# Altium schematic sheet current amplifier 03.SchDoc: PHOTOELECTRIC EFFECT
size A3; ApprovedBy: NHOPPASIT S.; CheckedBy: NHOPPASIT S.; Author: NHOPPASIT S.; DrawnBy: NHOPPASIT S.; DocumentNumber: EE-01; Revision: 1; SheetNumber: 1; SheetTotal: 1; Size: A3; PageSetup: Record=PageOptions?CenterHorizontal=True?CenterVertical=True?PrintScale=0.96?XCorrection=1.00?YCorrection=1.00?PrintKind=0?BorderSize=5000000?LeftOffset=0?BottomOffset=0?Orientation=2?PaperLength=1000?PaperWidth=1000?Scale=100?PaperSource=7?PrintQuality=-4?MediaType=1?DitherType=10?PaperKind=A4?PrintScaleMode=1; DocumentName: PHOTOELECTRIC EFFECT SCH; ProjectName: PHOTOELECTRIC EFFECT 01
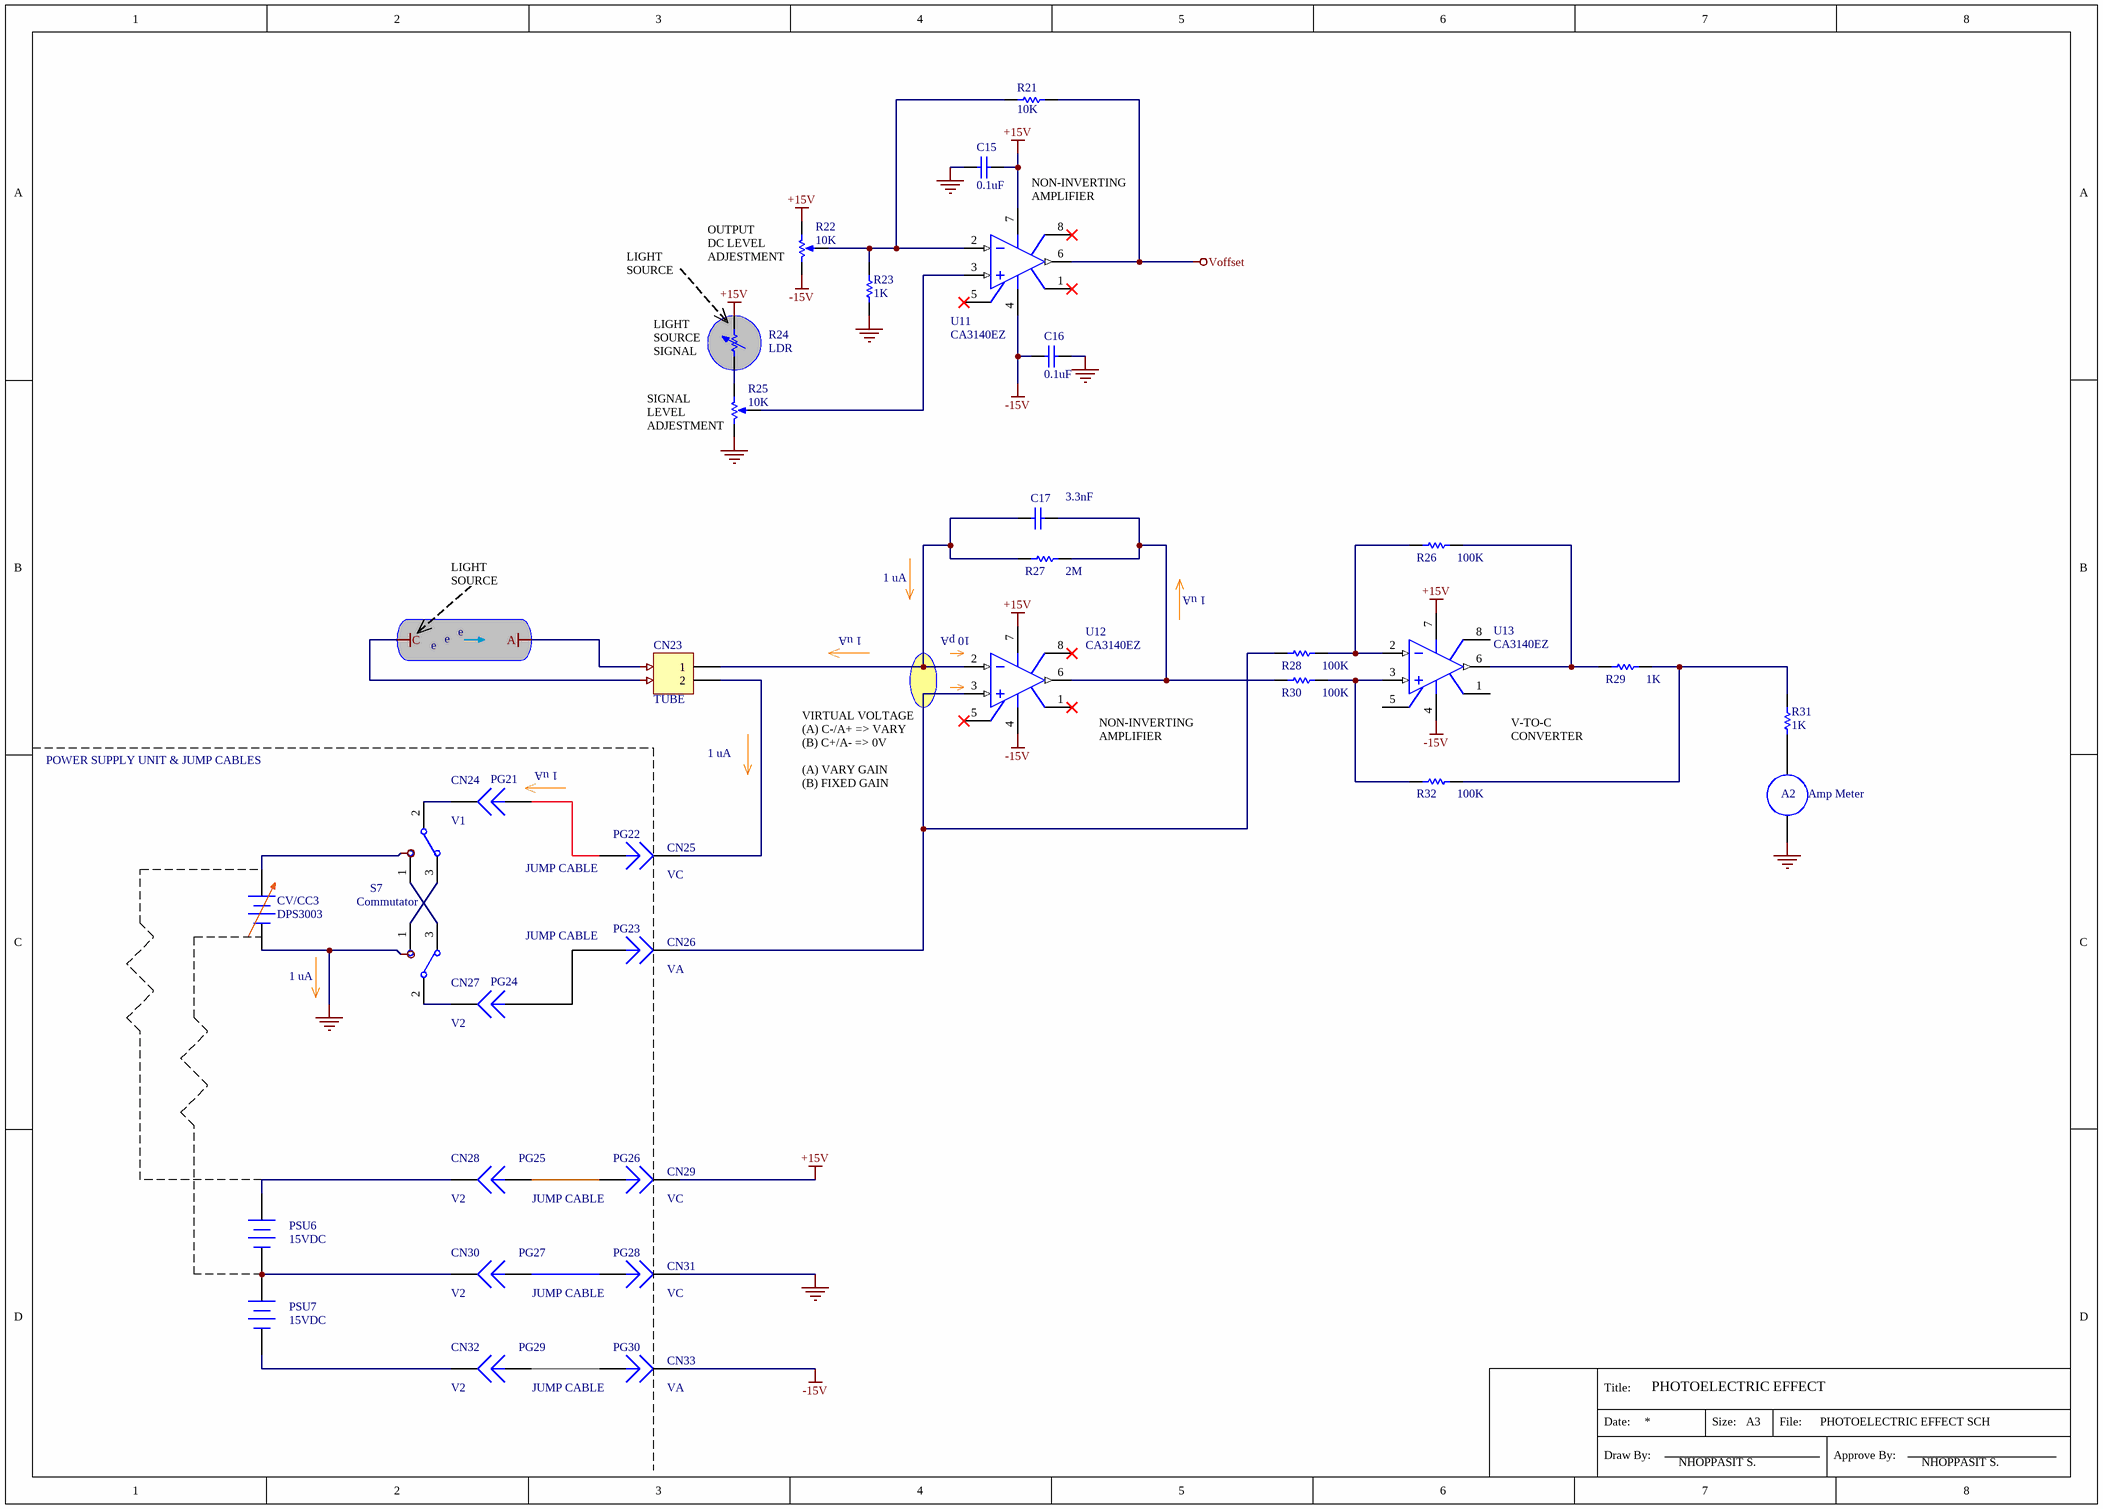
[diagram p0: current amplifier 03.SchDoc]

## Parts
A2  Amp Meter  [RAD-0.1]
C15  0.1uF  [RAD-0.3]
C16  0.1uF  [RAD-0.3]
C17  3.3nF  [RAD-0.3]
CN23  TUBE  [HDR1X2]
CN24  V1  [PIN1]
CN25  VC  [PIN1]
CN26  VA  [PIN1]
CN27  V2  [PIN1]
CN28  V2  [PIN1]
CN29  VC  [PIN1]
CN30  V2  [PIN1]
CN31  VC  [PIN1]
CN32  V2  [PIN1]
CN33  VA  [PIN1]
CV/CC3  DPS3003  [BAT-2]
PG21  Plug  [PIN1]  (value not drawn)
PG22  Plug  [PIN1]  (value not drawn)
PG23  Plug  [PIN1]  (value not drawn)
PG24  Plug  [PIN1]  (value not drawn)
PG25  Plug  [PIN1]  (value not drawn)
PG26  Plug  [PIN1]  (value not drawn)
PG27  Plug  [PIN1]  (value not drawn)
PG28  Plug  [PIN1]  (value not drawn)
PG29  Plug  [PIN1]  (value not drawn)
PG30  Plug  [PIN1]  (value not drawn)
PSU6  15VDC  [BAT-2]
PSU7  15VDC  [BAT-2]
R21  10K  [AXIAL-0.3]
R22  10K  [VR5]
R23  1K  [AXIAL-0.3]
R24  LDR  [AXIAL-0.7]
R25  10K  [VR5]
R26  100K  [AXIAL-0.3]
R27  2M  [AXIAL-0.3]
R28  100K  [AXIAL-0.3]
R29  1K  [AXIAL-0.3]
R30  100K  [AXIAL-0.3]
R31  1K  [AXIAL-0.3]
R32  100K  [AXIAL-0.3]
S7  Commutator  [TL36WW15050]
S8  SW-SPDT  [TL36WW15050]  (value not drawn)
U11  CA3140EZ  [H-08A]
U12  CA3140EZ  [H-08A]
U13  CA3140EZ  [H-08A]

## Nets
+15V: C15.2 CN29.1 R22.1(TOP) R24.2 U11.7(V+) U12.7(V+) U13.7(V+)
-15V: C16.1 CN33.1 R22.2(BOT) U11.4(V-) U12.4(V-) U13.4(V-)
A: A2.1 C15.1 C16.2 CN31.1 CV/CC3.1(+) CV/CC3.2(-) R23.1 R25.2(BOT)  [also labelled C, GND, VCC]
Voffset: R21.2 U11.6(OUT)
NetA2_2: A2.2 R31.1
NetC17_1: C17.1 CN23.1 R27.1 U12.2(IN-)
NetC17_2: C17.2 R27.2 R30.1 U12.6(OUT)
NetCN23_2: CN23.2 CN25.1
NetCN24_1: CN24.1 S7.2
NetCN26_1: CN26.1 R28.1 U12.3(IN+)
NetCN27_1: CN27.1 S8.2
NetCN28_1: CN28.1 PSU6.1(+)
NetCN30_1: CN30.1 PSU6.2(-) PSU7.1(+)
NetCN32_1: CN32.1 PSU7.2(-)
NetPG21_1: PG21.1 PG22.1
NetPG23_1: PG23.1 PG24.1
NetPG25_1: PG25.1 PG26.1
NetPG27_1: PG27.1 PG28.1
NetPG29_1: PG29.1 PG30.1
NetR21_1: R21.1 R22.3(TAP) R23.2 U11.2(IN-)
NetR24_1: R24.1 R25.1(TOP)
NetR25_3: R25.3(TAP) U11.3(IN+)
NetR26_1: R26.1 R28.2 U13.2(IN-)
NetR26_2: R26.2 R29.1 U13.6(OUT)
NetR29_2: R29.2 R31.2 R32.2
NetR30_2: R30.2 R32.1 U13.3(IN+)
NetS7_1: S7.1 S8.3
NetS7_3: S7.3 S8.1

Not connected (* = marked no-connect by the designer): U11 1(OS_NUL)* 5(OS_NUL)* 8(TAB)*; U12 1(OS_NUL)* 5(OS_NUL)* 8(TAB)*; U13 1(OS_NUL) 5(OS_NUL) 8(TAB)

## Notes on the sheet
- NON-INVERTING
  AMPLIFIER
- LIGHT SOURCE
- (near R22) OUTPUT
  DC LEVEL
  ADJESTMENT
- (near R24) LIGHT SOURCE
  SIGNAL
- (near R25) SIGNAL
  LEVEL
  ADJESTMENT
- 1 uA
- e
- (near U12) 10 pA
- POWER SUPPLY UNIT & JUMP CABLES
- (near PG21) 1 uA
- V-TO-C
  CONVERTER
- VIRTUAL VOLTAGE
  (A) C-/A+ => VARY
  (B) C+/A- => 0V
  (A) VARY GAIN
  (B) FIXED GAIN
- JUMP CABLE
- Title:
- Date:
- Draw By:
- Size:
- File:
- Approve By:

## Library data of the parts
A2 = Meter: Indicating Instrument; Note: Place a "letter" into the symbol to show the function of the meter or instrument; Published: 24-Mar-1999; LatestRevisionDate: 17-Jul-2002; LatestRevisionNote: Re-released for DXP Platform.; PackageReference: RAD-0.1; Publisher: Altium Limited; PackageDescription: Radial Cap, Thru-Hole; 2 Leads; 0.1 in Pin Spacing
C15-C17 = Cap: Capacitor; Published: 8-Jun-2000; LatestRevisionDate: 17-Jul-2002; LatestRevisionNote: Re-released for DXP Platform.; PackageReference: RAD-0.3; Publisher: Altium Limited; PackageDescription: Radial Cap, Thru-Hole; 2 Leads; 0.3 in Pin Spacing
  C15 C16: Value: 0.1uF
  C17: Value: 3.3nF
CN23 = Header 2: Header, 2-Pin; LatestRevisionDate: 17-Jul-2002; LatestRevisionNote: Re-released for DXP Platform.; Publisher: Altium Limited
CN24-CN33 = Socket: LatestRevisionDate: 17-Jul-2002; LatestRevisionNote: Re-released for DXP Platform.; Publisher: Altium Limited
CV/CC3 PSU6 PSU7 = Battery: Multicell Battery; Published: 24-Mar-1999; LatestRevisionDate: 17-Jul-2002; LatestRevisionNote: Re-released for DXP Platform.; PackageReference: BAT-2; Publisher: Altium Limited; PackageDescription: Battery; 2 Leads
R21 R23 R26-R32 = Res1: Resistor; Published: 8-Jun-2000; LatestRevisionDate: 17-Jul-2002; LatestRevisionNote: Re-released for DXP Platform.; PackageReference: AXIAL-0.3; Publisher: Altium Limited; PackageDescription: Axial Device, Thru-Hole; 2 Leads; 0.3 in Pin Spacing
  R21: Value: 10K
  R23 R29 R31: Value: 1K
  R26 R28 R30 R32: Value: 100K
  R27: Value: 2M
R22 R25 = RPot: Potentiometer; Sim Note: Enter the Resistance value and the set point into parameter fields.; Set Position: 0.5; Published: 8-Jun-2000; LatestRevisionDate: 17-Jul-2002; LatestRevisionNote: Re-released for DXP Platform.; PackageReference: VR5; Publisher: Altium Limited; PackageDescription: Variable Resistor, Thru-Hole; 3 Leads; Value: 10K
R24 = Res Adj1: Variable Resistor; Value: 1K; Set Position: 0.5; Published: 8-Jun-2000; LatestRevisionDate: 17-Jul-2002; LatestRevisionNote: Re-released for DXP Platform.; PackageReference: AXIAL-0.7; Publisher: Altium Limited; PackageDescription: Axial Device, Thru-Hole; 2 Leads; 0.7 in Pin Spacing
S7 S8 = SW-SPDT: SPDT Subminiature Toggle Switch, Right Angle Mounting, Vertical Actuation; Published: 24-Mar-1999; LatestRevisionDate: 17-Dec-2003; LatestRevisionNote: Schematic revised, PCB Footprint replaced.; DatasheetVersion: 05-Dec-2000; PackageReference: TL36WW15050; Publisher: Altium Limited; PackageDescription: Switch; 4 Leads; ComponentLink1Description: Manufacturer Link; ComponentLink1URL: http://www.apem.com
U11-U13 = Op Amp: FET Operational Amplifier; Published: 8-Jun-2000; LatestRevisionDate: 17-Jul-2002; LatestRevisionNote: Re-released for DXP Platform.; DatasheetVersion: REV. B; PackageVersion: 1990; PackageReference: H-08A; Publisher: Altium Limited; PackageDescription: Can; 8 Leads; Pin Circle Dia. 5.08 mm; Lead Dia. 0.53 mm (max); ComponentLink1Description: Manufacturer Link; ComponentLink1URL: http://www.analog.com/
PG21-PG30 = Plug: LatestRevisionDate: 17-Jul-2002; LatestRevisionNote: Re-released for DXP Platform.; Publisher: Altium Limited